# EAGLE schematic AZR3350 (EAGLE 9.2.2)
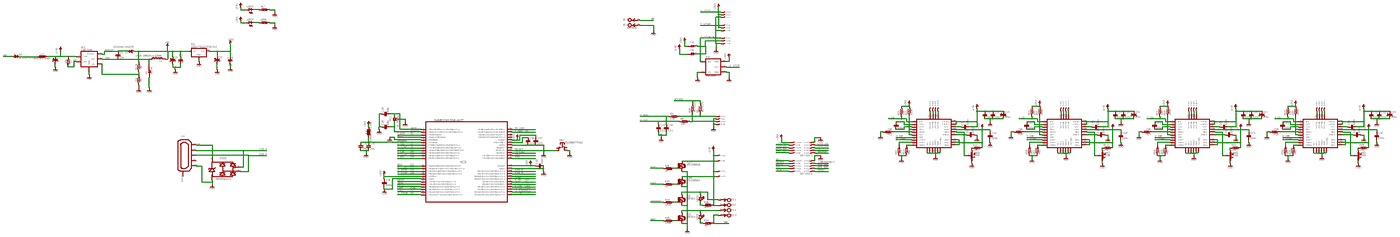
[diagram p0: schematic, sheet 1, overview]
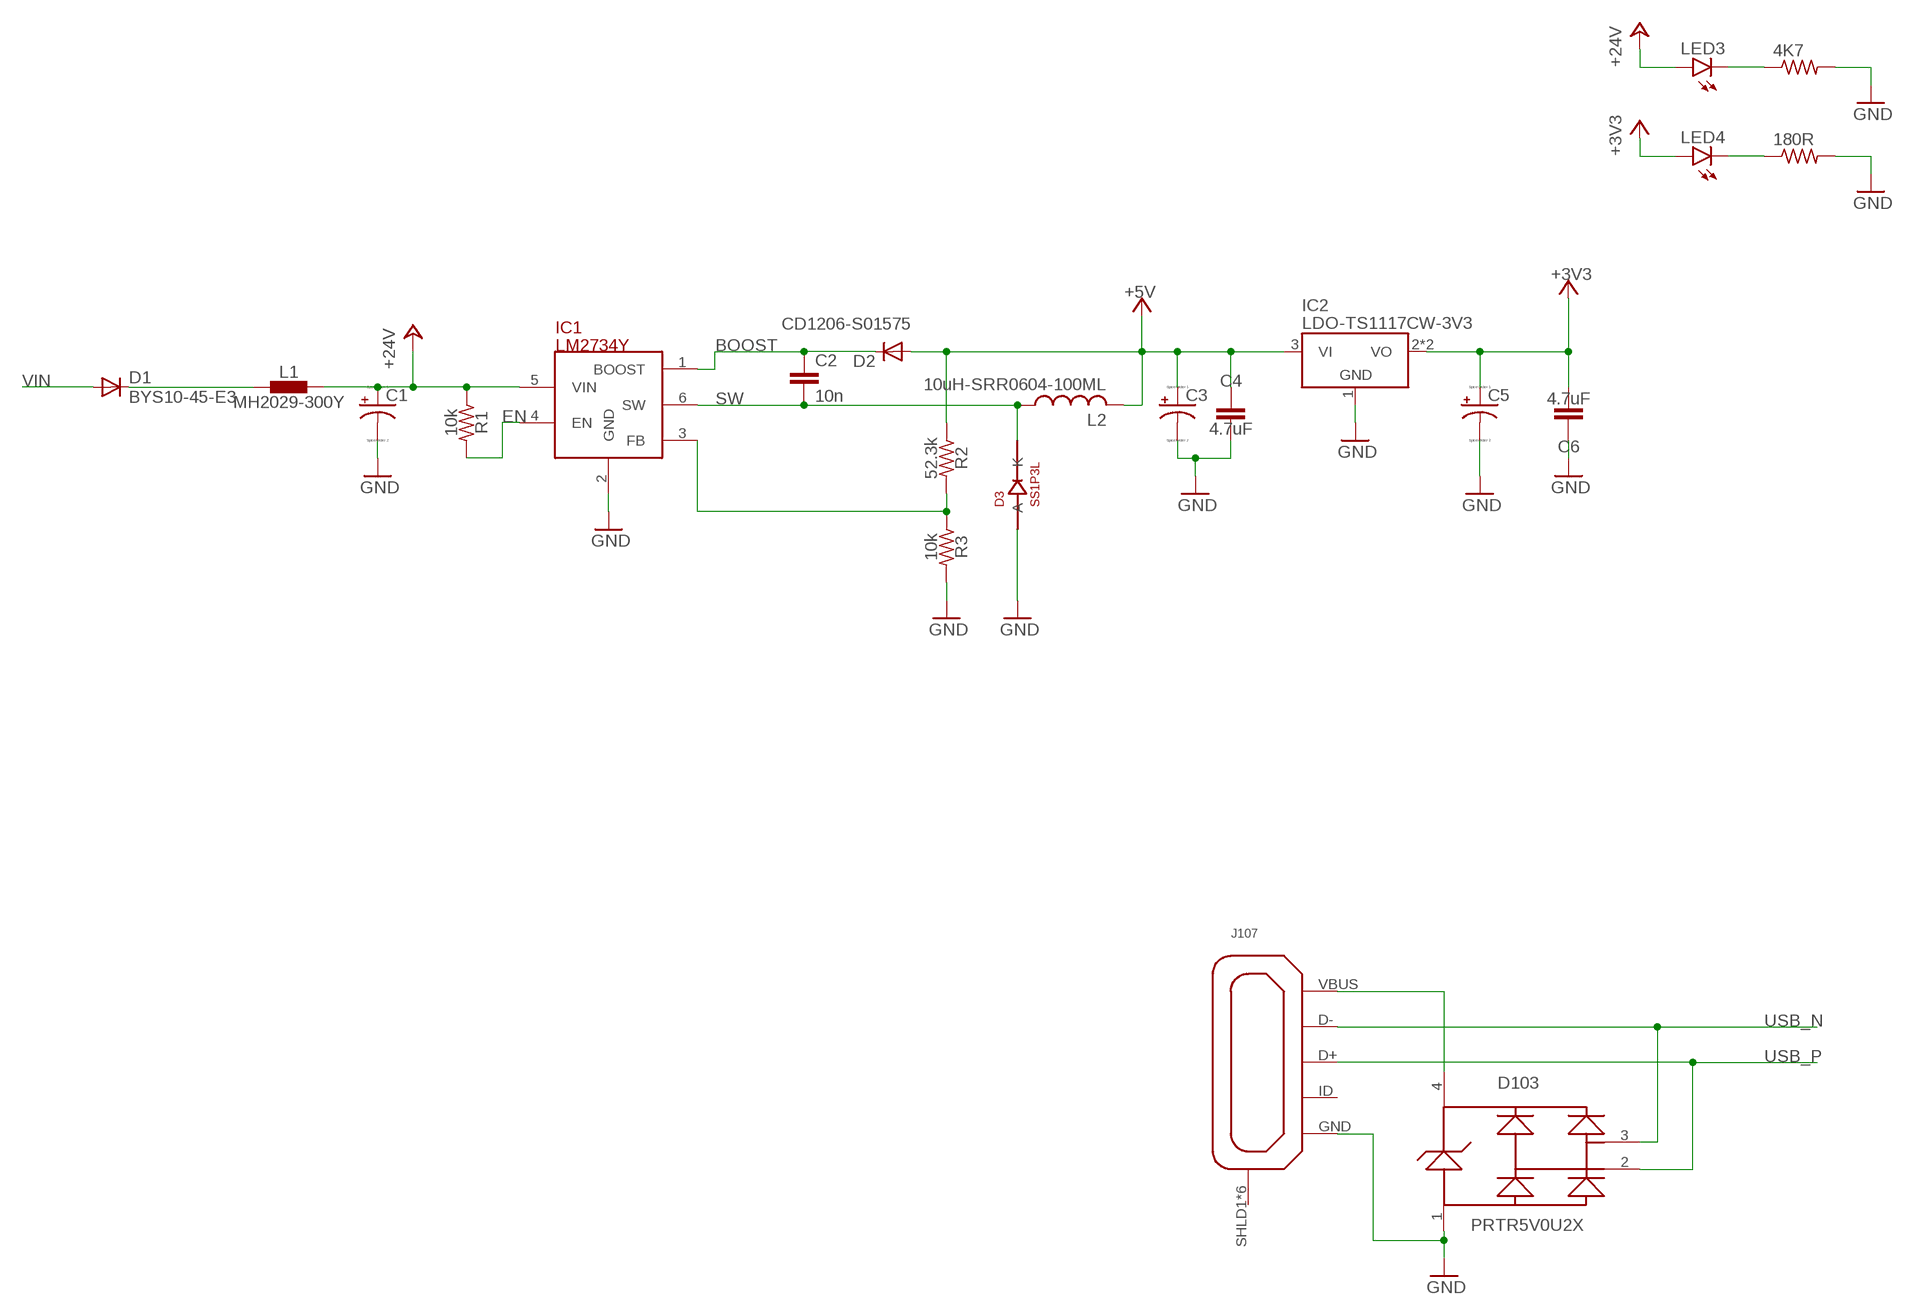
[diagram p1: schematic, sheet 1, part 1 of 4]
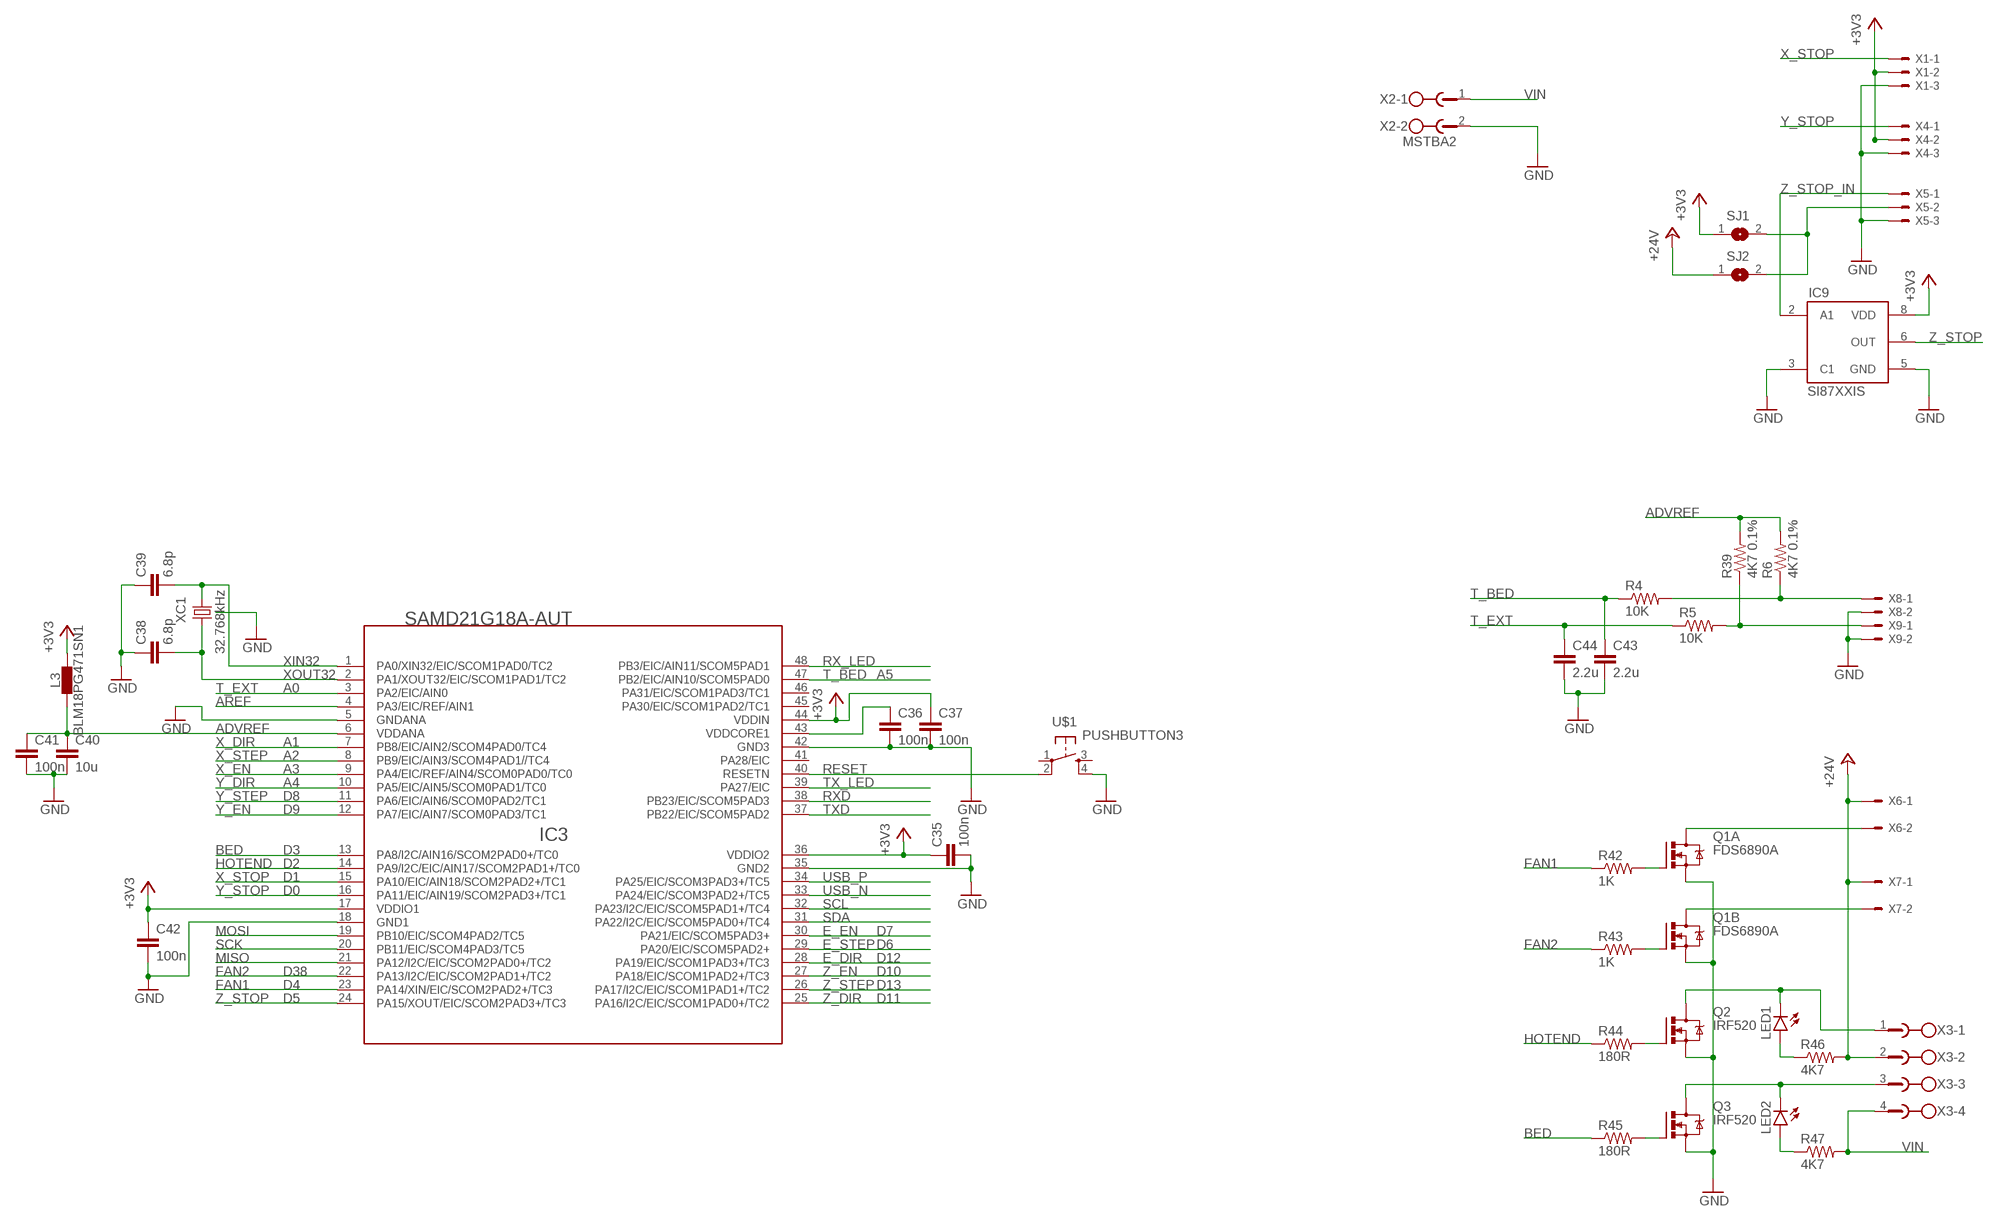
[diagram p2: schematic, sheet 1, part 2 of 4]
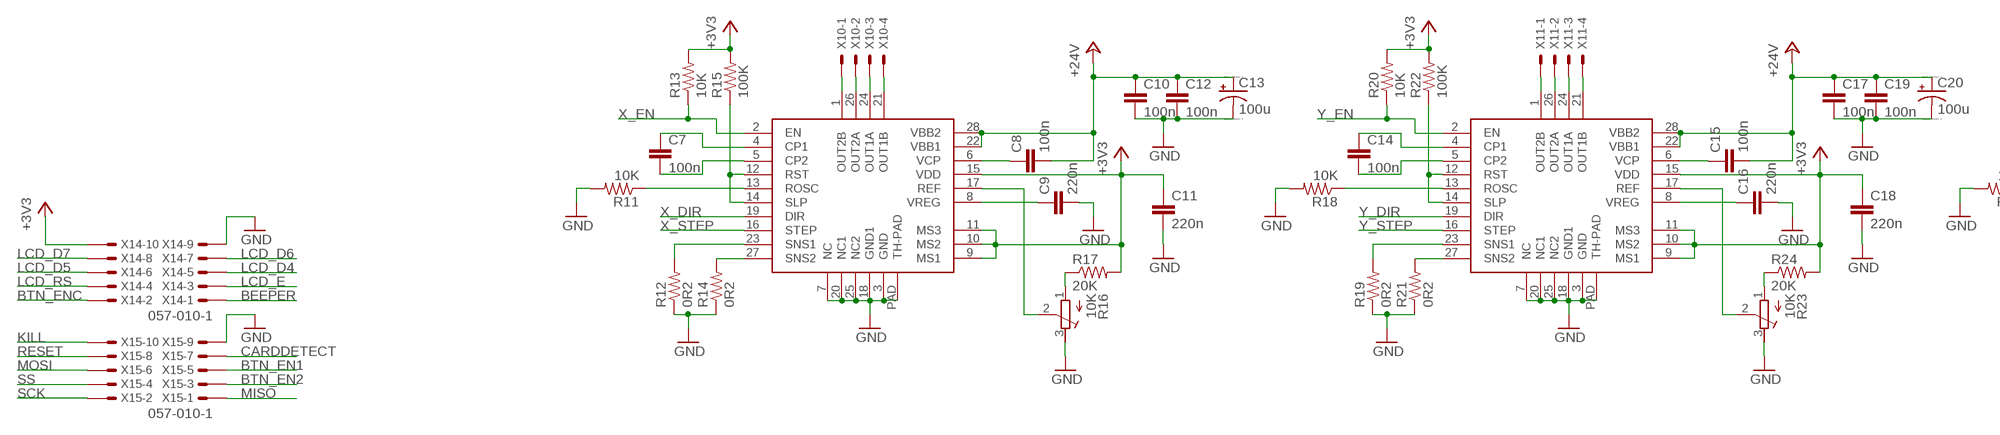
[diagram p3: schematic, sheet 1, part 3 of 4]
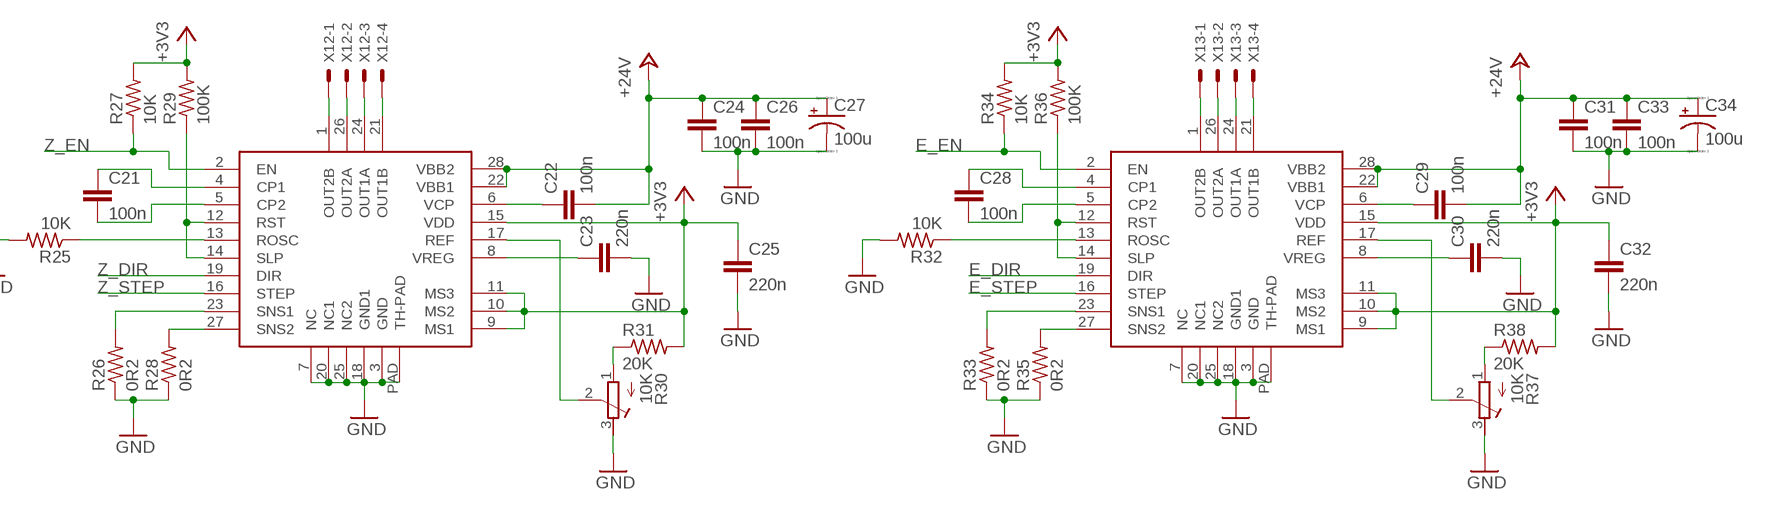
[diagram p4: schematic, sheet 1, part 4 of 4]

## Parts
4K7  R-US_R0402  [R0402]
180R  R-US_R0402  [R0402]
C1  10uF  CPOL-USD  [PANASONIC_D]
C2  10n  C-EUC0402  [C0402]
C3  47u  CPOL-USD  [PANASONIC_D]
C4  4.7uF  C-EUC0402  [C0402]
C5  10uF  CPOL-USD  [PANASONIC_D]
C6  4.7uF  C-EUC0402  [C0402]
C7  100n  C-EUC0402  [C0402]
C8  100n  C-EUC0402  [C0402]
C9  220n  C-EUC0402  [C0402]
C10  100n  C-EUC0402  [C0402]
C11  220n  C-EUC0402  [C0402]
C12  100n  C-EUC0402  [C0402]
C13  100u  CPOL-USD  [PANASONIC_D]
C14  100n  C-EUC0402  [C0402]
C15  100n  C-EUC0402  [C0402]
C16  220n  C-EUC0402  [C0402]
C17  100n  C-EUC0402  [C0402]
C18  220n  C-EUC0402  [C0402]
C19  100n  C-EUC0402  [C0402]
C20  100u  CPOL-USD  [PANASONIC_D]
C21  100n  C-EUC0402  [C0402]
C22  100n  C-EUC0402  [C0402]
C23  220n  C-EUC0402  [C0402]
C24  100n  C-EUC0402  [C0402]
C25  220n  C-EUC0402  [C0402]
C26  100n  C-EUC0402  [C0402]
C27  100u  CPOL-USD  [PANASONIC_D]
C28  100n  C-EUC0402  [C0402]
C29  100n  C-EUC0402  [C0402]
C30  220n  C-EUC0402  [C0402]
C31  100n  C-EUC0402  [C0402]
C32  220n  C-EUC0402  [C0402]
C33  100n  C-EUC0402  [C0402]
C34  100u  CPOL-USD  [PANASONIC_D]
C35  100n  C-EUC0402  [C0402]
C36  100n  C-EUC0402  [C0402]
C37  100n  C-EUC0402  [C0402]
C38  6.8p  C-EUC0402  [C0402]
C39  6.8p  C-EUC0402  [C0402]
C40  10u  C-EUC0603  [C0603]
C41  100n  C-EUC0402  [C0402]
C42  100n  C-EUC0402  [C0402]
C43  2.2u  C-EUC0402  [C0402]
C44  2.2u  C-EUC0402  [C0402]
D1  BYS10-45-E3  0012_CD1206-S01575  [MINIMELF]
D2  CD1206-S01575  0012_CD1206-S01575  [MINIMELF]
D3  SS1P3L  0025_SS1P3L-M3/84A  [DO220AAL]
D103  PRTR5V0U2XB  [SOT143B]
IC1  LM2734Y  0179_LM2734YMK  [SOT23-6]
IC2  LDO-TS1117CW-3V3  [SOT223]
IC3  SAMD21G18A-AUT  SAMD21G18A  [TQFP48]
IC5  A4988  [QFN28-TP]
IC6  A4988  [QFN28-TP]
IC7  A4988  [QFN28-TP]
IC8  A4988  [QFN28-TP]
IC9  SI87XXIS  [SOIC08-FAIRCHILD]
J107  ZX62-AB-5PA  [USB-MICRO-10103594]
L1  MH2029-300Y  INDUCTOR-0805  [C0805]
L2  10uH-SRR0604-100ML  0031_SRR0604-100ML  [SRR0604]
L3  BLM18PG471SN1  INDUCTOR-0603  [C0603]
LED1  LEDCHIPLED_0805  [CHIPLED_0805]
LED2  LEDCHIPLED_0805  [CHIPLED_0805]
LED3  LEDCHIPLED_0805  [CHIPLED_0805]
LED4  LEDCHIPLED_0805  [CHIPLED_0805]
Q1  FDS6890A  [M08A]
Q2  IRF520  [TO220BV]
Q3  IRF520  [TO220BV]
R1  10k  R-US_R0402  [R0402]
R2  52.3k  R-US_R0402  [R0402]
R3  10k  R-US_R0402  [R0402]
R4  10K  R-US_R0402  [R0402]
R5  10K  R-US_R0402  [R0402]
R6  4K7 0.1%  R-US_R0402  [R0402]
R11  10K  R-US_R0402  [R0402]
R12  0R2  R-US_R0805  [R0805]
R13  10K  R-US_R0402  [R0402]
R14  0R2  R-US_R0805  [R0805]
R15  100K  R-US_R0402  [R0402]
R16  10K  R-TRIMM3103  [RTRIM3103]
R17  20K  R-US_R0402  [R0402]
R18  10K  R-US_R0402  [R0402]
R19  0R2  R-US_R0805  [R0805]
R20  10K  R-US_R0402  [R0402]
R21  0R2  R-US_R0805  [R0805]
R22  100K  R-US_R0402  [R0402]
R23  10K  R-TRIMM3103  [RTRIM3103]
R24  20K  R-US_R0402  [R0402]
R25  10K  R-US_R0402  [R0402]
R26  0R2  R-US_R0805  [R0805]
R27  10K  R-US_R0402  [R0402]
R28  0R2  R-US_R0805  [R0805]
R29  100K  R-US_R0402  [R0402]
R30  10K  R-TRIMM3103  [RTRIM3103]
R31  20K  R-US_R0402  [R0402]
R32  10K  R-US_R0402  [R0402]
R33  0R2  R-US_R0805  [R0805]
R34  10K  R-US_R0402  [R0402]
R35  0R2  R-US_R0805  [R0805]
R36  100K  R-US_R0402  [R0402]
R37  10K  R-TRIMM3103  [RTRIM3103]
R38  20K  R-US_R0402  [R0402]
R39  4K7 0.1%  R-US_R0402  [R0402]
R42  1K  R-US_R0402  [R0402]
R43  1K  R-US_R0402  [R0402]
R44  180R  R-US_R0402  [R0402]
R45  180R  R-US_R0402  [R0402]
R46  4K7  R-US_R0402  [R0402]
R47  4K7  R-US_R0402  [R0402]
SJ1  SJ  [SJ]
SJ2  SJ  [SJ]
U$1  PUSHBUTTON3  [TS42_4PINS]
X1  KK-254-3  [MOLEX-KK-254-3]
X2  MSTBA2  [MSTBA2]
X3  MSTBV4  [MSTBV4]
X4  KK-254-3  [MOLEX-KK-254-3]
X5  KK-254-3  [MOLEX-KK-254-3]
X6  KK-254-2  [MOLEX-KK-254-2]
X7  KK-254-2  [MOLEX-KK-254-2]
X8  KK-254-2  [MOLEX-KK-254-2]
X9  KK-254-2  [MOLEX-KK-254-2]
X10  KK-254-4  [MOLEX-KK-254-4]
X11  KK-254-4  [MOLEX-KK-254-4]
X12  KK-254-4  [MOLEX-KK-254-4]
X13  KK-254-4  [MOLEX-KK-254-4]
X14  057-010-1  [057-010-1]
X15  057-010-1  [057-010-1]
XC1  32.768kHz  CRYSTALSMD  [CRYSTAL_TC26SMD]

## Nets
+3V3: C5.+ C6.2 C11.1 C18.1 C25.1 C32.1 C35.1 C37.1 C42.1 IC2.2(VO) IC2.4(VO) IC3.17(VDDIO1) IC3.36(VDDIO2) IC3.44(VDDIN) IC5.9(MS1) IC5.10(MS2) IC5.11(MS3) IC5.15(VDD) IC6.9(MS1) IC6.10(MS2) IC6.11(MS3) IC6.15(VDD) IC7.9(MS1) IC7.10(MS2) IC7.11(MS3) IC7.15(VDD) IC8.9(MS1) IC8.10(MS2) IC8.11(MS3) IC8.15(VDD) IC9.8(VDD) L3.2 LED4.A R13.2 R15.2 R17.2 R20.2 R22.2 R24.2 R27.2 R29.2 R31.2 R34.2 R36.2 R38.2 SJ1.1 X1.2 X4.2 X14.10
+5V [usbvcc]: C3.+ C4.1 D2.A IC2.3(VI) L2.P$2 R2.1
+24V: C1.+ C8.2 C10.1 C12.1 C13.+ C15.2 C17.1 C19.1 C20.+ C22.2 C24.1 C26.1 C27.+ C29.2 C31.1 C33.1 C34.+ IC1.5(VIN) IC5.22(VBB1) IC5.28(VBB2) IC6.22(VBB1) IC6.28(VBB2) IC7.22(VBB1) IC7.28(VBB2) IC8.22(VBB1) IC8.28(VBB2) L1.2 LED3.A R1.1 R46.2 SJ2.1 X3.2 X6.1 X7.1
ADVREF: C40.1 C41.1 IC3.6(VDDANA) L3.1 R6.2 R39.2
AREF: IC3.4(PA3/EIC/REF/AIN1)
BED: IC3.13(PA8/I2C/AIN16/SCOM2PAD0+/TC0) R45.1
BEEPER: X14.1
BOOST: C2.1 D2.C IC1.1(BOOST)
BTN_EN1: X15.5
BTN_EN2: X15.3
BTN_ENC: X14.2
CARDDETECT: X15.7
CP1E: C28.1 IC8.4(CP1)
CP1X: C7.1 IC5.4(CP1)
CP1Y: C14.1 IC6.4(CP1)
CP1Z: C21.1 IC7.4(CP1)
CP2E: C28.2 IC8.5(CP2)
CP2X: C7.2 IC5.5(CP2)
CP2Y: C14.2 IC6.5(CP2)
CP2Z: C21.2 IC7.5(CP2)
E_DIR: IC3.28(PA19/EIC/SCOM1PAD3+/TC3) IC8.19(DIR)
E_EN: IC3.30(PA21/EIC/SCOM5PAD3+) IC8.2(EN) R34.1
E_STEP: IC3.29(PA20/EIC/SCOM5PAD2+) IC8.16(STEP)
EMOT1A: IC8.24(OUT1A) X13.3
EMOT1B: IC8.21(OUT1B) X13.4
EMOT2A: IC8.26(OUT2A) X13.2
EMOT2B: IC8.1(OUT2B) X13.1
EN: IC1.4(EN) R1.2
FAN1: IC3.23(PA14/XIN/EIC/SCOM2PAD2+/TC3) R42.1
FAN2: IC3.22(PA13/I2C/EIC/SCOM2PAD1+/TC2) R43.1
FB: IC1.3(FB) R2.2 R3.1
GND: 4K7.2 180R.2 C1.- C3.- C4.2 C5.- C6.1 C9.2 C10.2 C11.2 C12.2 C13.- C16.2 C17.2 C18.2 C19.2 C20.- C23.2 C24.2 C25.2 C26.2 C27.- C30.2 C31.2 C32.2 C33.2 C34.- C35.2 C36.2 C37.2 C38.1 C39.1 C40.2 C41.2 C42.2 C43.2 C44.2 D3.P$2(A) D103.1 IC1.2(GND) IC2.1(GND) IC3.5(GNDANA) IC3.18(GND1) IC3.35(GND2) IC3.42(GND3) IC5.3(GND) IC5.7(NC) IC5.18(GND1) IC5.20(NC1) IC5.25(NC2) IC5.PAD(TH-PAD) IC6.3(GND) IC6.7(NC) IC6.18(GND1) IC6.20(NC1) IC6.25(NC2) IC6.PAD(TH-PAD) IC7.3(GND) IC7.7(NC) IC7.18(GND1) IC7.20(NC1) IC7.25(NC2) IC7.PAD(TH-PAD) IC8.3(GND) IC8.7(NC) IC8.18(GND1) IC8.20(NC1) IC8.25(NC2) IC8.PAD(TH-PAD) IC9.3(C1) IC9.5(GND) J107.GND Q1.1(A:S) Q1.3(B:S) Q2.S Q3.S R3.2 R11.2 R12.1 R14.1 R16.3(E) R18.2 R19.1 R21.1 R23.3(E) R25.2 R26.1 R28.1 R30.3(E) R32.2 R33.1 R35.1 R37.3(E) U$1.4 X1.3 X2.2 X4.3 X5.3 X8.2 X9.2 X14.9 X15.9 XC1.P$1(GND)
HOTEND: IC3.14(PA9/I2C/EIC/AIN17/SCOM2PAD1+/TC0) R44.1
KILL: X15.10
LCD_D4: X14.5
LCD_D5: X14.6
LCD_D6: X14.7
LCD_D7: X14.8
LCD_E: X14.3
LCD_RS: X14.4
MISO: IC3.21(PA12/I2C/EIC/SCOM2PAD0+/TC2) X15.1
MOSI: IC3.19(PB10/EIC/SCOM4PAD2/TC5) X15.6
N$1: D1.C L1.1
N$2: R4.2 R6.1 X8.1
N$3: R5.2 R39.1 X9.1
N$11: D103.4 J107.VBUS(VUSB)
N$12: SJ1.2 SJ2.2 X5.2
N$13: Q1.2(A:G) R42.2
N$18: Q1.4(B:G) R43.2
N$19: R23.1(A) R24.1
N$20: Q2.G R44.2
N$21: Q1.5(B:D) Q1.6(B:D) X7.2
N$22: Q1.7(A:D) Q1.8(A:D) X6.2
N$23: LED1.C Q2.D X3.1
N$24: LED2.C Q3.D X3.3
N$25: Q3.G R45.2
N$26: LED1.A R46.1
N$27: LED2.A R47.1
N$33: 4K7.1 LED3.C
N$34: 180R.1 LED4.C
N$51: R30.1(A) R31.1
REFE: IC8.17(REF) R37.2(S)
REFE-IN: R37.1(A) R38.1
REFX: IC5.17(REF) R16.2(S)
REFX-IN: R16.1(A) R17.1
REFY: IC6.17(REF) R23.2(S)
REFZ: IC7.17(REF) R30.2(S)
RESET: IC3.40(RESETN) U$1.2 X15.8
ROSCE: IC8.13(ROSC) R32.1
ROSCX: IC5.13(ROSC) R11.1
ROSCY: IC6.13(ROSC) R18.1
ROSCZ: IC7.13(ROSC) R25.1
RSTE: IC8.12(RST) IC8.14(SLP) R36.1
RSTX: IC5.12(RST) IC5.14(SLP) R15.1
RSTY: IC6.12(RST) IC6.14(SLP) R22.1
RSTZ: IC7.12(RST) IC7.14(SLP) R29.1
RX_LED: IC3.48(PB3/EIC/AIN11/SCOM5PAD1)
RXD: IC3.38(PB23/EIC/SCOM5PAD3)
SCK: IC3.20(PB11/EIC/SCOM4PAD3/TC5) X15.2
SCL: IC3.32(PA23/I2C/EIC/SCOM5PAD1+/TC4)
SDA: IC3.31(PA22/I2C/EIC/SCOM5PAD0+/TC4)
SNS1E: IC8.23(SNS1) R33.2
SNS1X: IC5.23(SNS1) R12.2
SNS1Y: IC6.23(SNS1) R19.2
SNS1Z: IC7.23(SNS1) R26.2
SNS2E: IC8.27(SNS2) R35.2
SNS2X: IC5.27(SNS2) R14.2
SNS2Y: IC6.27(SNS2) R21.2
SNS2Z: IC7.27(SNS2) R28.2
SS: X15.4
SW [USB]: C2.2 D3.P$1(K) IC1.6(SW) L2.P$1
T_BED: C43.1 IC3.47(PB2/EIC/AIN10/SCOM5PAD0) R4.1
T_EXT: C44.1 IC3.3(PA2/EIC/AIN0) R5.1
TX_LED: IC3.39(PA27/EIC)
TXD: IC3.37(PB22/EIC/SCOM5PAD2)
USB_N [diff]: D103.3 IC3.33(PA24/EIC/SCOM3PAD2+/TC5) J107.D-
USB_P [diff]: D103.2 IC3.34(PA25/EIC/SCOM3PAD3+/TC5) J107.D+
VCPE: C29.1 IC8.6(VCP)
VCPX: C8.1 IC5.6(VCP)
VCPY: C15.1 IC6.6(VCP)
VCPZ: C22.1 IC7.6(VCP)
VDDCORE: C36.1 IC3.43(VDDCORE1)
VIN: D1.A R47.2 X2.1 X3.4
VREGE: C30.1 IC8.8(VREG)
VREGX: C9.1 IC5.8(VREG)
VREGY: C16.1 IC6.8(VREG)
VREGZ: C23.1 IC7.8(VREG)
X_DIR: IC3.7(PB8/EIC/AIN2/SCOM4PAD0/TC4) IC5.19(DIR)
X_EN: IC3.9(PA4/EIC/REF/AIN4/SCOM0PAD0/TC0) IC5.2(EN) R13.1
X_STEP: IC3.8(PB9/EIC/AIN3/SCOM4PAD1//TC4) IC5.16(STEP)
X_STOP: IC3.15(PA10/EIC/AIN18/SCOM2PAD2+/TC1) X1.1
XIN32: C39.2 IC3.1(PA0/XIN32/EIC/SCOM1PAD0/TC2) XC1.2
XMOT1A: IC5.24(OUT1A) X10.3
XMOT1B: IC5.21(OUT1B) X10.4
XMOT2A: IC5.26(OUT2A) X10.2
XMOT2B: IC5.1(OUT2B) X10.1
XOUT32: C38.2 IC3.2(PA1/XOUT32/EIC/SCOM1PAD1/TC2) XC1.1
Y_DIR: IC3.10(PA5/EIC/AIN5/SCOM0PAD1/TC0) IC6.19(DIR)
Y_EN: IC3.12(PA7/EIC/AIN7/SCOM0PAD3/TC1) IC6.2(EN) R20.1
Y_STEP: IC3.11(PA6/EIC/AIN6/SCOM0PAD2/TC1) IC6.16(STEP)
Y_STOP: IC3.16(PA11/EIC/AIN19/SCOM2PAD3+/TC1) X4.1
YMOT1A: IC6.24(OUT1A) X11.3
YMOT1B: IC6.21(OUT1B) X11.4
YMOT2A: IC6.26(OUT2A) X11.2
YMOT2B: IC6.1(OUT2B) X11.1
Z_DIR: IC3.25(PA16/I2C/EIC/SCOM1PAD0+/TC2) IC7.19(DIR)
Z_EN: IC3.27(PA18/EIC/SCOM1PAD2+/TC3) IC7.2(EN) R27.1
Z_STEP: IC3.26(PA17/I2C/EIC/SCOM1PAD1+/TC2) IC7.16(STEP)
Z_STOP: IC3.24(PA15/XOUT/EIC/SCOM2PAD3+/TC3) IC9.6(OUT)
Z_STOP_IN: IC9.2(A1) X5.1
ZMOT1A: IC7.24(OUT1A) X12.3
ZMOT1B: IC7.21(OUT1B) X12.4
ZMOT2A: IC7.26(OUT2A) X12.2
ZMOT2B: IC7.1(OUT2B) X12.1
Unconnected: IC3.41(PA28/EIC) IC3.45(PA30/EIC/SCOM1PAD2/TC1) IC3.46(PA31/EIC/SCOM1PAD3/TC1) J107.ID J107.SHLD1(SH) J107.SHLD2(SH) J107.SHLD3(SH) J107.SHLD4(SH) J107.SHLD5(SH) J107.SHLD6(SH) U$1.1 U$1.3

## Notes on the sheet
- A5
- A0
- A1
- A2
- A3
- A4
- D8
- D9
- D3
- D2
- D1
- D0
- D7
- D6
- D12
- D38 | D10
- D4 | D13
- D5 | D11

## Library data of the parts
4K7 180R R1-R6 R11-R15 R17-R22 R24-R29 R31-R36 R38 R39 R42-R47 = resistor:R-US_: RESISTOR, American symbol
C1 C3 C5 C13 C20 C27 C34 = resistor:CPOL-US: POLARIZED CAPACITOR, American symbol
C2 C4 C6-C12 C14-C19 C21-C26 C28-C33 C35-C44 = resistor:C-EU: CAPACITOR, European symbol
D1 = Diodi:0012_CD1206-S01575: small-signal high-speed Switching Diodes CD1206; CASE: 1206; MONTHLY_USAGE: _____; PART_NUMBER: CD1206-S01575; PRICE: _____; SUPPLIER: _____; TYPE: Diodi; VALUE: CD1206-S01575
D2 = Diodi:0012_CD1206-S01575: small-signal high-speed Switching Diodes CD1206; CASE: 1206; MONTHLY_USAGE: _____; PART_NUMBER: CD1206-S01575; PRICE: _____; SUPPLIER: _____; TYPE: Diodi
D3 = Diodi:0025_SS1P3L-M3/84A: 1A 30V Schottky Barrier Rectifiers -SS1P3L-M3/84A; CASE: SMP; MONTHLY_USAGE: _____; PART_NUMBER: SS1P3L-M3/84A; PRICE: _____; SUPPLIER: _____; TYPE: Diodi
D103 = Arduino:PRTR5V0U2X
IC1 = Circuito Integrato:0179_LM2734YMK: 1A Load Step-Down DC-DC Regulator - LM2734Y Switching; CASE: SOT23-5; MONTHLY_USAGE: _____; PART_NUMBER: LM2734YMK; PRICE: _____; SUPPLIER: _____; TYPE: Circuito_Integrato; VALUE: LM2734YMK
IC2 = we-power:LDO: LDOs TS1117 800mA max 15V - compatible NCP1117 1A max 20V TS9011 250mA max 12V - compatible AP2210 300mA max 15V TS5204 150mA max 16V
IC3 = Zero_V1.0:SAMD21G18A: Atmel D21 32bit ARM Cortex-M0 microcontroller - 48 PIN TQFP 256KB flash memory + 32KB SRAM
IC5-IC8 = RepRapjr:A4988
IC9 = misc:SI87XX
J107 = Arduino:ZX62-AB-5PA
L1 L3 = Arduino:INDUCTOR: Inductors
L2 = Induttanze:0031_SRR0604-100ML: SRR0604-100ML; CASE: SMD_6,5x6,5; MONTHLY_USAGE: _____; PART_NUMBER: SRR0604-100ML; PRICE: _____; SUPPLIER: _____; TYPE: Induttanze
LED1-LED4 = led:LED: LED OSRAM: - CHIPLED LG R971, LG N971, LY N971, LG Q971, LY Q971, LO R971, LY R971 LH N974, LH R974 LS Q976, LO Q976, LY Q976 LO Q996 - Hyper CHIPLED LW Q18S LB Q993, LB Q99A, LB R99A - SideLED LS A670, LO A670, LY A670, LG A670, LP A670 LB A673, LV A673, LT A673, LW A673 LH A674 LY A675 LS A676, LA A676, LO A676, LY A676, LW A676 LS A679, LY A679, LG A679 - Hyper Micro SIDELED® LS Y876, LA Y876, LO Y876, LY Y876 LT Y87S - SmartLED LW L88C, LW L88S LB L89C, LB L89S, LG L890 LS L89K, LO L89K, LY L89K LS L896, LA L896, LO L896, LY L896 - TOPLED LS T670, LO T670, LY T670, LG T670, LP T670 LSG T670, LSP T670, LSY T670, LOP T670, LYG T670 LG T671, LOG T671, LSG T671 LB T673, LV T673, LT T673, LW T673 LH T674 LS T676, LA T676, LO T676, LY T676, LB T676, LH T676, LSB T676, LW T676 LB T67C, LV T67C, LT T67C, LS T67K, LO T67K, LY T67K, LW E67C LS E67B, LA E67B, LO E67B, LY E67B, LB E67C, LV E67C, LT E67C LW T67C LS T679, LY T679, LG T679 LS T770, LO T770, LY T770, LG T770, LP T770 LB T773, LV T773, LT T773, LW T773 LH T774 LS E675, LA E675, LY E675, LS T675 LS T776, LA T776, LO T776, LY T776, LB T776 LHGB T686 LT T68C, LB T68C - Hyper Mini TOPLED® LB M676 - Mini TOPLED Santana® LG M470 LS M47K, LO M47K, LY M47K Source: http://www.osram.convergy.de LUXEON: - LUMILED® LXK2-PW12-R00, LXK2-PW12-S00, LXK2-PW14-U00, LXK2-PW14-V00 LXK2-PM12-R00, LXK2-PM12-S00, LXK2-PM14-U00 LXK2-PE12-Q00, LXK2-PE12-R00, LXK2-PE12-S00, LXK2-PE14-T00, LXK2-PE14-U00 LXK2-PB12-K00, LXK2-PB12-L00, LXK2-PB12-M00, LXK2-PB14-N00, LXK2-PB14-P00, LXK2-PB14-Q00 LXK2-PR12-L00, LXK2-PR12-M00, LXK2-PR14-Q00, LXK2-PR14-R00 LXK2-PD12-Q00, LXK2-PD12-R00, LXK2-PD12-S00 LXK2-PH12-R00, LXK2-PH12-S00 LXK2-PL12-P00, LXK2-PL12-Q00, LXK2-PL12-R00 Source: www.luxeon.com KINGBRIGHT: KA-3528ASYC Source: www.kingbright.com
Q1 = transistor-power:FDS6890A: Dual N-Channel 2.5V Specified PowerTrenchTM MOSFET Source: FDS6890A.pdf
Q2 Q3 = transistor-power:IRF520: HEXFET Power MOSFET
R16 R23 R30 R37 = resistor:R-TRIMM: Trimm resistor
SJ1 SJ2 = jumper:SJ: SMD solder JUMPER
U$1 = Zero_V1.0:PUSHBUTTON3: TS42 Dongnan Electronics Tact switch VDC 12V - 50mA
X1 X4 X5 = con-other:KK-254-3
X2 = con-phoenix-508:MSTBA2: PHOENIX; MF: FARNELL; MPN: 1757242; OC_FARNELL: 3705171; OC_NEWARK: 71C4161
X3 = con-phoenix-508:MSTBV4: PHOENIX; MPN: MSTBV 2,5/4-GF-5.08; OC_FARNELL: 1792794; OC_NEWARK: 69R9847
X6-X9 = con-other:KK-254-2
X10-X13 = con-other:KK-254-4
X14 X15 = con-panduit:057-010-: CONNECTOR 10-pin series 057 contact pc board low profile headers; OC_FARNELL: unknown; OC_NEWARK: unknown
XC1 = Arduino:CRYSTAL: Crystals

## Net classes
1 USB: width 0.102 mm, drill 0.1 mm
2 gnd: width 0.102 mm, drill 0.1 mm
3 usbvcc: width 0.102 mm, drill 0.1 mm, clearance 0.15 mm
4 diff: width 0.152 mm